# Altium schematic sheet ATMEGA32U4-AU.SchDoc
size A4
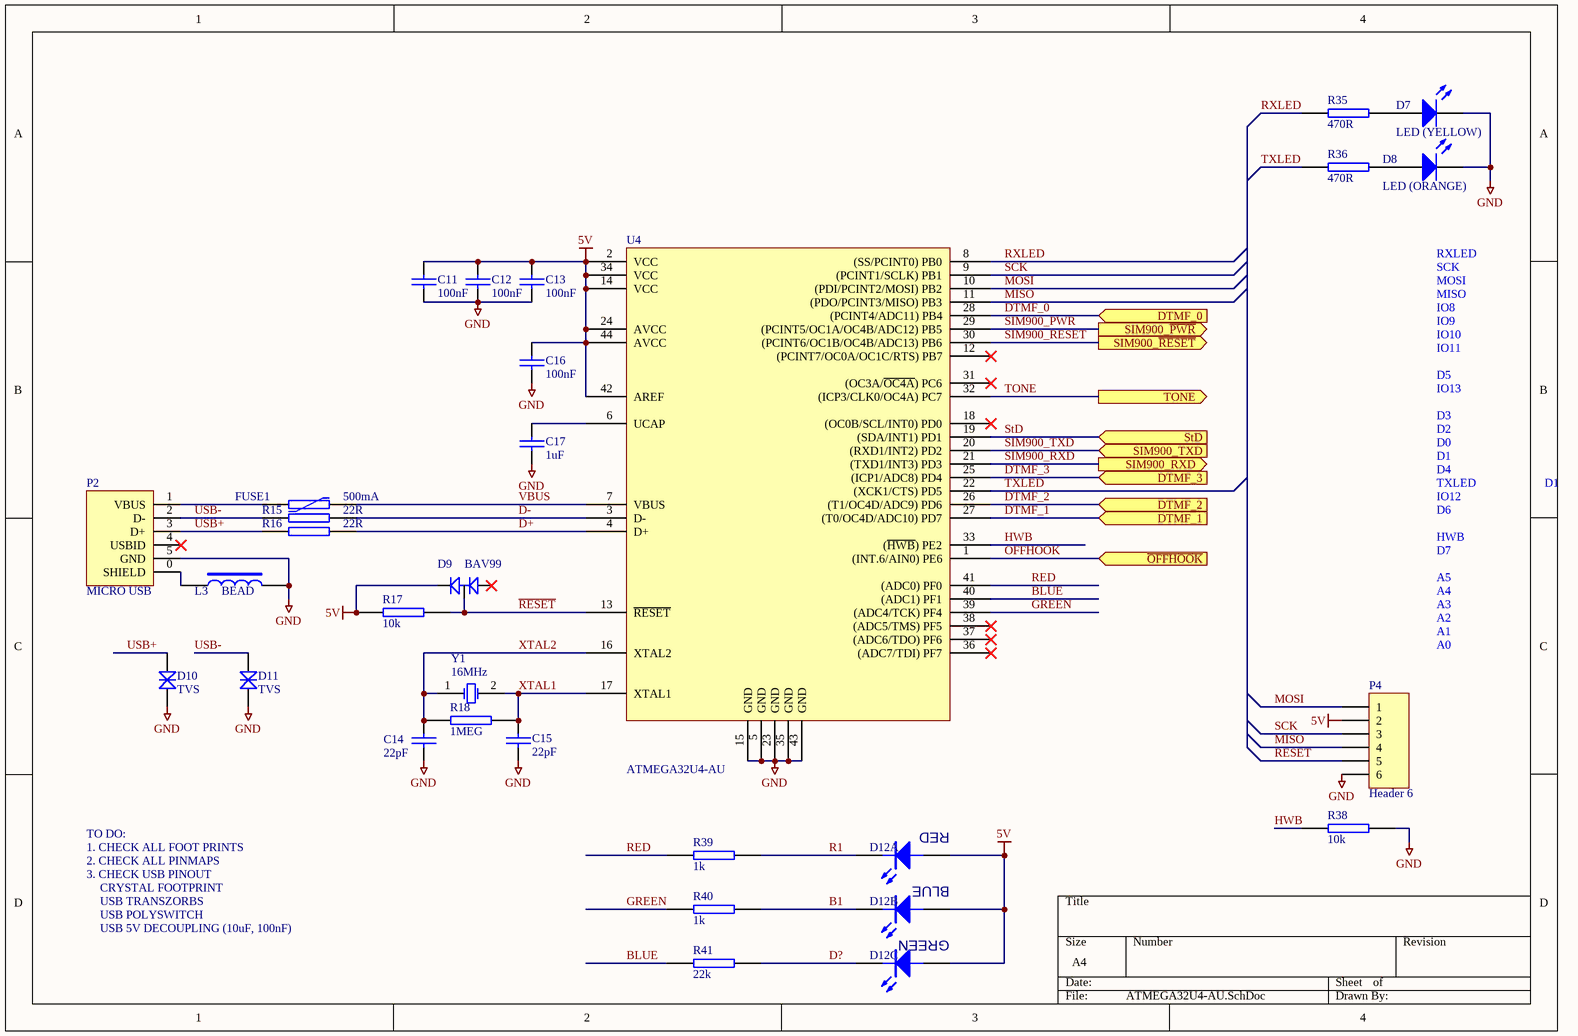
[diagram p0: ATMEGA32U4-AU.SchDoc]

## Parts
C11  100nF  [CAP (3D) - 0603]
C12  100nF  [CAP (3D) - 0603]
C13  100nF  [CAP (3D) - 0603]
C14  22pF  [CAP (3D) - 0603]
C15  22pF  [CAP (3D) - 0603]
C16  100nF  [CAP (3D) - 0603]
C17  1uF  [CAP (3D) - 0805]
D7  LED (YELLOW)  [LED(3D) YELLOW - 0805]
D8  LED (ORANGE)  [LED(3D) ORANGE - 0805]
D9  BAV99  [SOT23-3L]
D10  TVS  [TVS (3D) - 0603]
D11  TVS  [TVS (3D) - 0603]
D12  RGB 5mm  [LED(3D) 5MM VERTICAL (RGB) - COMMON ANODE]  (value not drawn)  (parts A,B,C of 3)
FUSE1  500mA  [miniSMD Polyswitch]
L3  BEAD  [RES (3D) - 1210]
P2  MICRO USB  [MICRO USB]
P4  Header 6  [HDR2X3 (3D)]
R15  22R  [RES (3D) - 0603]
R16  22R  [RES (3D) - 0603]
R17  10k  [RES (3D) - 0603]
R18  1MEG  [RES (3D) - 0603]
R35  470R  [RES (3D) - 0603]
R36  470R  [RES (3D) - 0603]
R38  10k  [RES (3D) - 0603]
R39  1k  [RES (3D) - 0603]
R40  1k  [RES (3D) - 0603]
R41  22k  [RES (3D) - 0603]
U4  ATMEGA32U4-AU  [TQFP44]
Y1  16MHz  [HC49/4H_SMX]

## Ports
DTMF_0 (in), DTMF_1 (in), DTMF_2 (in), DTMF_3 (in), SIM900_RXD (out), SIM900_TXD (in), SIM900_~{PWR} (out), SIM900_~{RESET} (out), StD (in), TONE (out), ~{OFFHOOK} (in)

## Nets
5V: C11.1 C12.1 C13.1 C16.1 D9.2(C2) D12.2(A) P4.2 R17.2 U4.2(VCC) U4.14(VCC) U4.24(AVCC) U4.34(VCC) U4.42(AREF) U4.44(AVCC)
GND: C11.2 C12.2 C13.2 C14.2 C15.2 C16.2 C17.2 D7.2(K) D8.2(K) D10.1(A) D11.1(A) L3.2 P2.5(GND) P4.6 R38.1 U4.5(GND) U4.15(GND) U4.23(GND) U4.35(GND) U4.43(GND)
B1: D12.4(K) R40.2
BLUE: R41.1 U4.40((ADC1)_PF1)
D+: R16.2 U4.4(D+)
D-: R15.2 U4.3(D-)
D?: D12.3(K) R41.2
DTMF_0: U4.28((PCINT4/ADC11)_PB4) ; port DTMF_0
DTMF_1: U4.27((T0/OC4D/ADC10)_PD7) ; port DTMF_1
DTMF_2: U4.26((T1/OC4D/ADC9)_PD6) ; port DTMF_2
DTMF_3: U4.25((ICP1/ADC8)_PD4) ; port DTMF_3
GREEN: R40.1 U4.39((ADC4/TCK)_PF4)
HWB: R38.2 U4.33((~{HWB})_PE2)
MISO: P4.4 U4.11((PDO/PCINT3/MISO)_PB3)
MOSI: P4.1 U4.10((PDI/PCINT2/MOSI)_PB2)
~{OFFHOOK}: U4.1((INT.6/AIN0)_PE6) ; port ~{OFFHOOK}
R1: D12.1(K) R39.2
~{RESET}: D9.3(C1/A2) P4.5 R17.1 U4.13(~{RESET})
RED: R39.1 U4.41((ADC0)_PF0)
RXLED: R35.1 U4.8((SS/PCINT0)_PB0)
SCK: P4.3 U4.9((PCINT1/SCLK)_PB1)
SIM900_~{PWR}: U4.29((PCINT5/OC1A/OC4B/ADC12)_PB5) ; port SIM900_~{PWR}
SIM900_~{RESET}: U4.30((PCINT6/OC1B/OC4B/ADC13)_PB6) ; port SIM900_~{RESET}
SIM900_RXD: U4.21((TXD1/INT3)_PD3) ; port SIM900_RXD
SIM900_TXD: U4.20((RXD1/INT2)_PD2) ; port SIM900_TXD
StD: U4.19((SDA/INT1)_PD1) ; port StD
TONE: U4.32((ICP3/CLK0/OC4A)_PC7) ; port TONE
TXLED: R36.1 U4.22((XCK1/CTS)_PD5)
USB+: D10.2(K) P2.3(D+) R16.1
USB-: D11.2(K) P2.2(D-) R15.1
VBUS: FUSE1.2 U4.7(VBUS)
XTAL1: C15.1 R18.2 U4.17(XTAL1) Y1.2(OSC2)
XTAL2: C14.1 R18.1 U4.16(XTAL2) Y1.1(OSC1)
NetC17_1: C17.1 U4.6(UCAP)
NetD7_1: D7.1(A) R35.2
NetD8_1: D8.1(A) R36.2
NetFUSE1_1: FUSE1.1 P2.1(VBUS)
NetL3_1: L3.1 P2.0(SHIELD)

Not connected (* = marked no-connect by the designer): D9 1(A1)*; P2 4(USBID)*; U4 12((PCINT7/OC0A/OC1C/RTS)_PB7)* 18((OC0B/SCL/INT0)_PD0)* 31((OC3A/~{OC4A})_PC6)* 36((ADC7/TDI)_PF7)* 37((ADC6/TDO)_PF6)* 38((ADC5/TMS)_PF5)*

## Notes on the sheet
- IO8
- RXLED
- SCK
- MOSI
- MISO
- IO9
- IO10
- IO11
- D5
- IO13
- D3
- D0
- D2
- IO12
- D6
- D4
- D1
- TXLED
- A5
- HWB
- D7
- A0
- A1
- A2
- A3
- A4
- TO DO:
- 1. CHECK ALL FOOT PRINTS
- 2. CHECK ALL PINMAPS
- 3. CHECK USB PINOUT
- USB TRANSZORBS
- CRYSTAL FOOTPRINT
- USB POLYSWITCH
- USB 5V DECOUPLING (10uF, 100nF)
- (in symbol RGB_5mm, part A) RED
- (in symbol RGB_5mm, part B) BLUE
- (in symbol RGB_5mm, part C) GREEN

## Library data of the parts
C11-C13 C16 = CAP SMD 0603 100nF: CAPACITOR SMD 0603; Manufacturer: Murata; Manufacturer Part No.: GCM188R71C104KA37D; Mouser Part no.: 81-GCM188R71C104KA7D; Farnell Part no.: 1414610; Web link: http://au.mouser.com/ProductDetail/Murata/GCM188R71C104KA37D/?qs=aEuGZpxfbxWKAxwYn%252beTMg%3d%3d; value: 100nF
C14 C15 = CAP SMD 0603 1nF: CAPACITOR SMD 0603; value: 22pF
C17 = CAP SMD 0805 1uF: CAPACITOR SMD 0805; Manufacturer Part No.: 80-C0805S103K5R; Mouser Part no.: 80-C0805S103K5R; Web link: http://au.mouser.com/ProductDetail/Kemet/C0805S103K5RACTU/?qs=sGAEpiMZZMukHu%252bjC5l7YburjfFXXRNJ7O%2favhHW5F4%3d; value: 1uF
D7 = LED 0805 YELLOW
D8 = LED 0805 ORANGE
D9 = BAV99: DUAL DIODE, BAV99; Manufacturer: FAIRCHILD SEMICONDUCTOR; Mouser Part no.: 771-BAV99/T3; Farnell Part no.: 9843612; Manufacturer Part No.: BAV99; PackageReference: SOT-23; value: BAV99; Web link: http://au.mouser.com/ProductDetail/NXP-Semiconductors/BAV99-T3/?qs=sGAEpiMZZMtldOIVIVqa3WNg7zlWz8nBhXHsMX6ttIg%3d
D10 D11 = TVS DIODE: Transient Voltage Suppression (TVS) Diode; Manufacturer Part No.: CG0603MLC-05E; Value: TVS
D12 = RGB_5mm: value: RGB 5mm; Web link: eBay
FUSE1 = POLYSWITCH 500mA 1812: Mouser Part No.: PTS181216V050; value: 500mA
L3 = INDUCTOR SMD 1210 100uH: INDUCTOR SMD 1210; Manufacturer Part No.: 2512063007Y3; Value: BEAD
P4 = Header 6: Header, 6-Pin; LatestRevisionDate: 17-Jul-2002; LatestRevisionNote: Re-released for DXP Platform.; Publisher: Altium Limited
R15 R16 R18 = RES SMD 0603 0R: RESISTOR SMD 0603 0R
  R15 R16: value: 22R
  R18: Value: 1MEG
R17 R38 = RES SMD 0603 10k: RESISTOR SMD 0603 10k; Manufacturer: Bourns; Manufacturer Part No.: CR0603FX-1002ELF; Mouser Part no.: 652-CR0603FX-1002ELF; Web link: http://au.mouser.com/Search/Refine.aspx?Keyword=652-CR0603FX-1002ELF; value: 10k
R35 R36 = RES SMD 0603 590R: RESISTOR SMD 0603 590R; Substitute Allowed: Yes; value: 470R
R39 R40 = RES SMD 0603 10k: RESISTOR SMD 0603; Manufacturer: Bourns; Manufacturer Part No.: CR0603-JW-102ELF; Mouser Part no.: 652-CR0603-JW-102ELF; Farnell Part no.: 9331700; Web link: http://au.mouser.com/ProductDetail/Bourns/CR0603-JW-102ELF/?qs=sGAEpiMZZMu61qfTUdNhG2nPoCjtvs%252bRXTOJv8O9Kbk%3d; value: 1k
R41 = RES SMD 0603 10k: RESISTOR SMD 0603; Manufacturer: Bourns; Manufacturer Part No.: CR0603-FX-4223ELF; Mouser Part no.: 652-CR0603FX-4223ELF; Web link: http://au.mouser.com/ProductDetail/Bourns/CR0603-FX-4223ELF/?qs=CCIlxZRRv7hqply3rAXy4hrq0%2fcMGkZy; value: 22k
U4 = ATmega32U4: Mouser Part No.: 556-ATMEGA32U4-AU; Value: ATMEGA32U4-AU
Y1 = XTAL: Crystal Oscillator; Mouser Part No.: 520-CSM1600-20-X; Value: 16MHz